# EAGLE design clock (EAGLE 9.0.0)
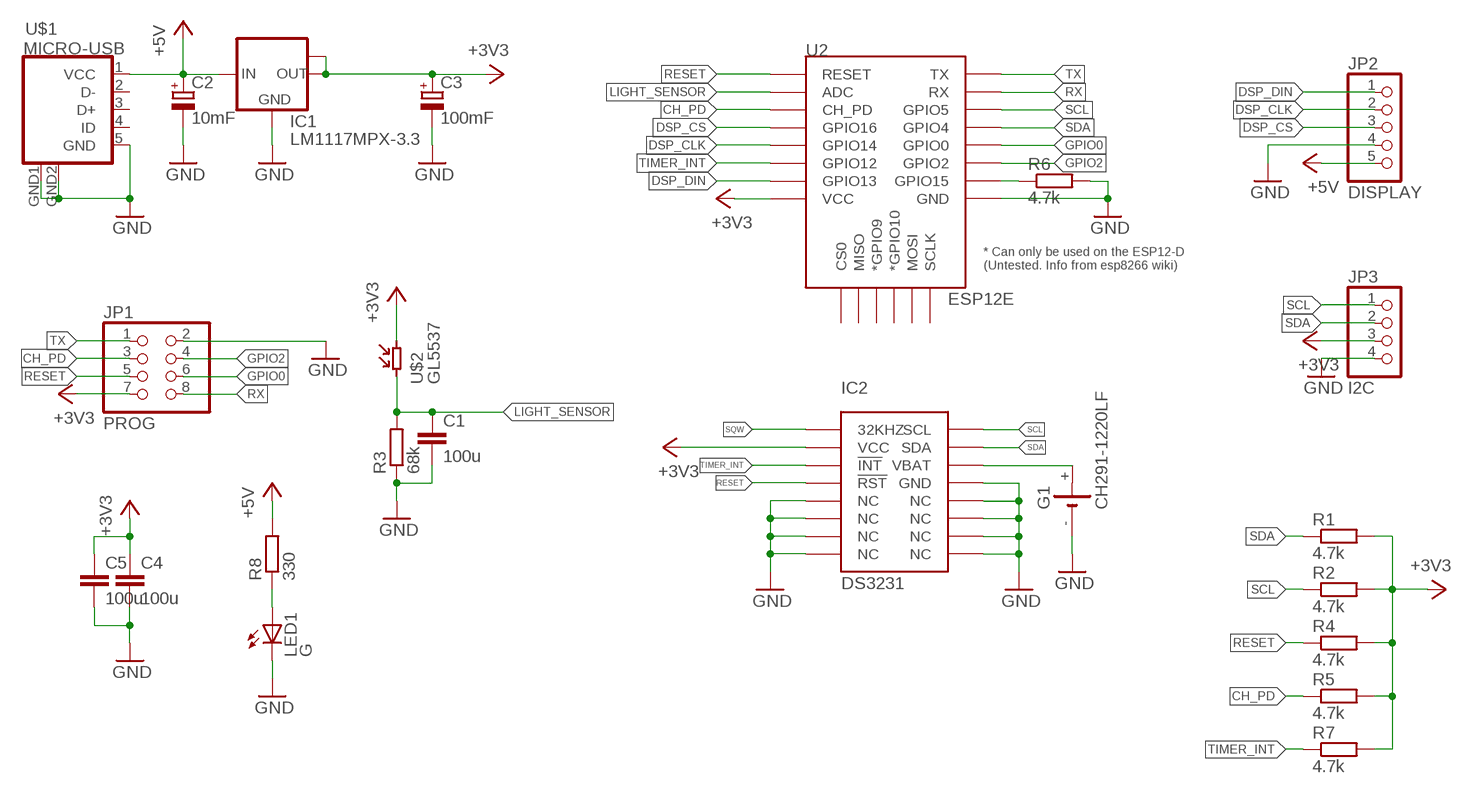
[diagram p0: schematic, sheet 1]

## Parts
C1  100u  C-EUC0805  [C0805]
C2  10mF  CPOL-EUA/3216-18W  [A/3216-18W]
C3  100mF  CPOL-EUA/3216-18W  [A/3216-18W]
C4  100u  C-EUC0805  [C0805]
C5  100u  C-EUC0805  [C0805]
G1  CH291-1220LF  [CH291-1220LF]
IC1  LM1117MPX-3.3  [SOT223]
IC2  DS3231  DS3231SOIC-16W  [SOIC-16W]
JP1  PROG  PINHD-2X4  [2X04]
JP2  DISPLAY  PINHD-1X5  [1X05]
JP3  I2C  PINHD-1X4  [1X04]
LED1  G  LEDCHIPLED_0805  [CHIPLED_0805]
R1  4.7k  R-EU_M0805  [M0805]
R2  4.7k  R-EU_M0805  [M0805]
R3  68k  R-EU_M0805  [M0805]
R4  4.7k  R-EU_M0805  [M0805]
R5  4.7k  R-EU_M0805  [M0805]
R6  4.7k  R-EU_M0805  [M0805]
R7  4.7k  R-EU_M0805  [M0805]
R8  330  R-EU_M0805  [M0805]
U2  ESP12E  ESP12ESMD  [ESP12E-SMD]
U$1  MICRO-USB  [MICRO-USB]
U$2  GL5537  [GL55]

## Nets
+3V3 [power]: C3.+ C4.1 C5.1 IC1.2(OUT) IC1.TAB(OUT1) IC2.2(VCC) JP1.7 JP3.3 R1.2 R2.2 R4.2 R5.2 R7.2 U2.VCC U$2.P$2
+5V [power]: C2.+ IC1.3(IN) JP2.5 R8.2 U$1.1(VCC)
CH_PD: JP1.3 R5.1 U2.CH_PD
DSP_CLK: JP2.2 U2.GPIO14
DSP_CS: JP2.3 U2.GPIO16
DSP_DIN: JP2.1 U2.GPIO13
GND [gnd]: C1.2 C2.- C3.- C4.2 C5.2 G1.- IC1.1(GND) IC2.5(NC) IC2.6(NC) IC2.7(NC) IC2.8(NC) IC2.9(NC) IC2.10(NC) IC2.11(NC) IC2.12(NC) IC2.13(GND) JP1.2 JP2.4 JP3.4 LED1.C R3.1 R6.2 U2.GND U$1.5(GND) U$1.GND1(GND) U$1.GND2(GND)
GPIO0: JP1.6 U2.GPIO0
GPIO2: JP1.4 U2.GPIO2
GPIO15: R6.1 U2.GPIO15
LIGHT_SENSOR: C1.1 R3.2 U2.ADC U$2.P$1
N$3: LED1.A R8.1
N$4: G1.+ IC2.14(VBAT)
RESET: IC2.4(!RST) JP1.5 R4.1 U2.RESET
RX: JP1.8 U2.RXD0(RX)
SCL: IC2.16(SCL) JP3.1 R2.1 U2.GPIO5
SDA: IC2.15(SDA) JP3.2 R1.1 U2.GPIO4
SQW: IC2.1(32KHZ)
TIMER_INT: IC2.3(!INT) R7.1 U2.GPIO12
TX: JP1.1 U2.TXD0(TX)
Unconnected: U2.CS0 U2.GPIO9(*GPIO9) U2.GPIO10(*GPIO10) U2.MISO U2.MOSI U2.SCLK U$1.2(D-) U$1.3(D+) U$1.4(ID)

## Library data of the parts
C1 C4 C5 = rcl:C-EU: CAPACITOR, European symbol; SPICEPREFIX: C
C2 C3 = rcl:CPOL-EU: POLARIZED CAPACITOR, European symbol; SPICEPREFIX: C
G1 = battery:CH291-1220LF: Battery Holder, SMT, 12mm multicomp PART NO. CH291-1220LF Source: Data sheet <http://www.farnell.com/datasheets/1505860.pdf>
IC1 = lm1117:LM1117MPX-*
IC2 = DS3231_industrialberry:DS3231
JP1 = pinhead:PINHD-2X4: PIN HEADER
JP2 = pinhead:PINHD-1X5: PIN HEADER
JP3 = pinhead:PINHD-1X4: PIN HEADER
LED1 = led:LED: LED OSRAM: - CHIPLED LG R971, LG N971, LY N971, LG Q971, LY Q971, LO R971, LY R971 LH N974, LH R974 LS Q976, LO Q976, LY Q976 LO Q996 - Hyper CHIPLED LW Q18S LB Q993, LB Q99A, LB R99A - SideLED LS A670, LO A670, LY A670, LG A670, LP A670 LB A673, LV A673, LT A673, LW A673 LH A674 LY A675 LS A676, LA A676, LO A676, LY A676, LW A676 LS A679, LY A679, LG A679 - Hyper Micro SIDELED® LS Y876, LA Y876, LO Y876, LY Y876 LT Y87S - SmartLED LW L88C, LW L88S LB L89C, LB L89S, LG L890 LS L89K, LO L89K, LY L89K LS L896, LA L896, LO L896, LY L896 - TOPLED LS T670, LO T670, LY T670, LG T670, LP T670 LSG T670, LSP T670, LSY T670, LOP T670, LYG T670 LG T671, LOG T671, LSG T671 LB T673, LV T673, LT T673, LW T673 LH T674 LS T676, LA T676, LO T676, LY T676, LB T676, LH T676, LSB T676, LW T676 LB T67C, LV T67C, LT T67C, LS T67K, LO T67K, LY T67K, LW E67C LS E67B, LA E67B, LO E67B, LY E67B, LB E67C, LV E67C, LT E67C LW T67C LS T679, LY T679, LG T679 LS T770, LO T770, LY T770, LG T770, LP T770 LB T773, LV T773, LT T773, LW T773 LH T774 LS E675, LA E675, LY E675, LS T675 LS T776, LA T776, LO T776, LY T776, LB T776 LHGB T686 LT T68C, LB T68C - Hyper Mini TOPLED® LB M676 - Mini TOPLED Santana® LG M470 LS M47K, LO M47K, LY M47K Source: http://www.osram.convergy.de LUXEON: - LUMILED® LXK2-PW12-R00, LXK2-PW12-S00, LXK2-PW14-U00, LXK2-PW14-V00 LXK2-PM12-R00, LXK2-PM12-S00, LXK2-PM14-U00 LXK2-PE12-Q00, LXK2-PE12-R00, LXK2-PE12-S00, LXK2-PE14-T00, LXK2-PE14-U00 LXK2-PB12-K00, LXK2-PB12-L00, LXK2-PB12-M00, LXK2-PB14-N00, LXK2-PB14-P00, LXK2-PB14-Q00 LXK2-PR12-L00, LXK2-PR12-M00, LXK2-PR14-Q00, LXK2-PR14-R00 LXK2-PD12-Q00, LXK2-PD12-R00, LXK2-PD12-S00 LXK2-PH12-R00, LXK2-PH12-S00 LXK2-PL12-P00, LXK2-PL12-Q00, LXK2-PL12-R00 Source: www.luxeon.com KINGBRIGHT: KA-3528ASYC Source: www.kingbright.com
R1-R8 = rcl:R-EU_: RESISTOR, European symbol; SPICEPREFIX: R
U2 = esp8266modules:ESP12E: ESP12E Module
U$1 = microusb:MICRO-USB: Micro USB B connector
U$2 = misc:GL5537: GL5537 Photoresistor

## Net classes
0 default: width 0.3 mm
1 power: width 0.5 mm
2 gnd: width 0.5 mm

## Board
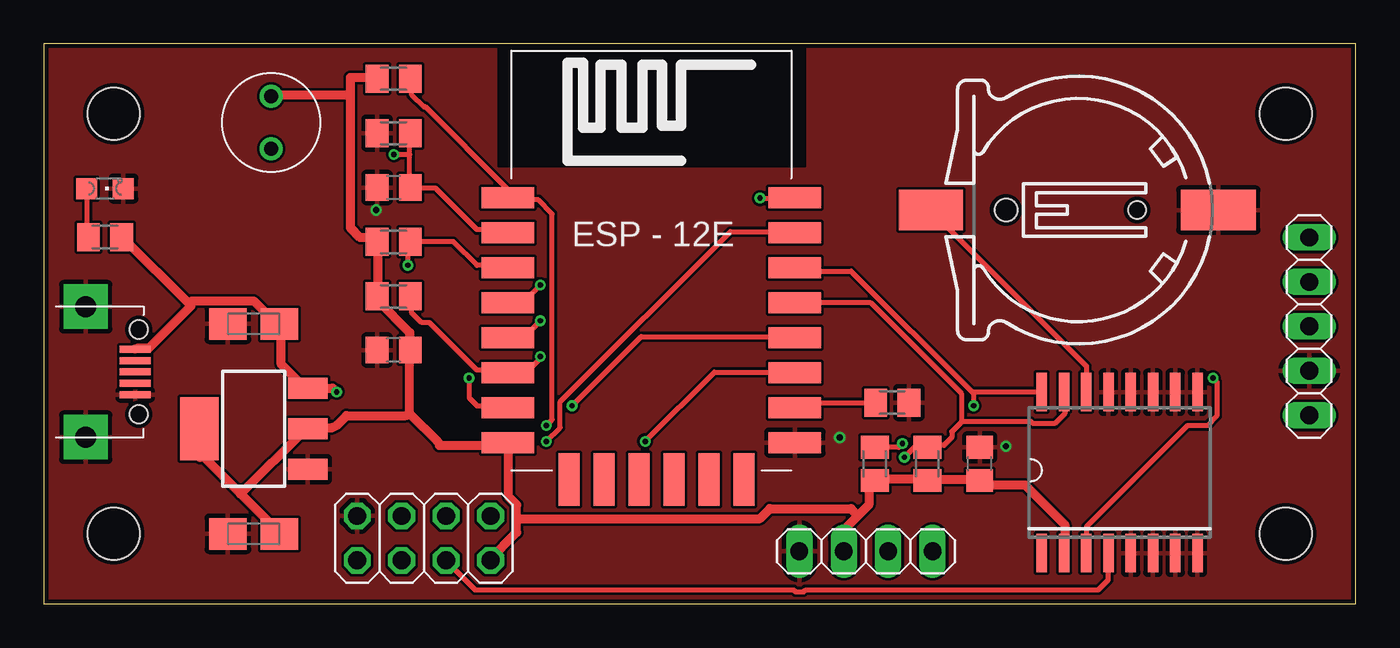
[diagram p1: board, top side]
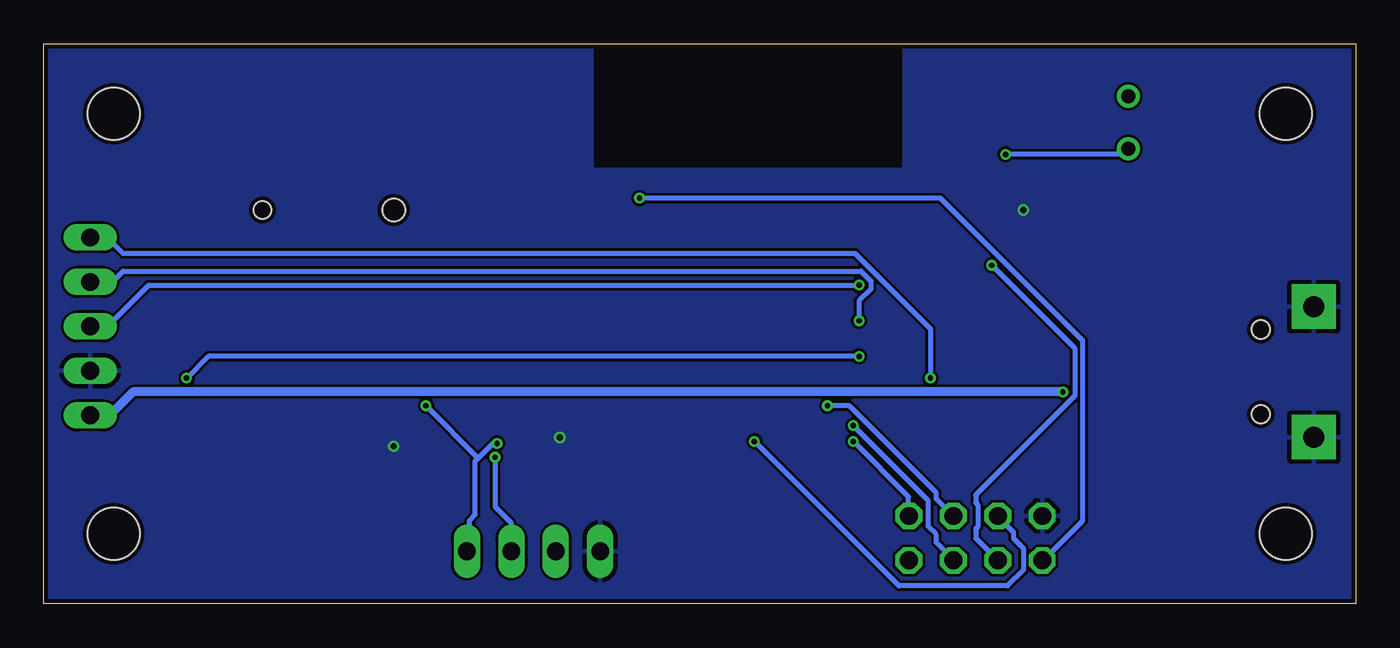
[diagram p2: board, bottom side, seen from below]

Size 75 x 32 mm. Coordinates in mm from the lower left corner, seen from the top.
Outline: 0,0 75,0 75,32 0,32 0,0
Copper layers (1*16): Top 0.035mm / dielectric 1.5mm / Bottom 0.035mm
Design rules "SeeedStudio_2layer_DRU_no_angle_20140221": minimum track width 6mil, minimum drill 12mil, track to track 6mil, track to pad 6mil, pad to pad 6mil, via to via 6mil, smd to smd 0mil, copper to edge 10mil, drill to drill 10mil, minimum pad ring 10mil, minimum via ring 6mil, stop-mask expansion 2mil, vias tented up to drill 100mil, thermal gap 10mil
Holes 3 mm at 4,4 4,28 71,4 71,28
tRestrict: area 26,25 to 43.5,32
bRestrict: area 26,25 to 43.5,32

### Footprints (pad centres in the part's own frame; a part is rotated, then mirrored left to right if it is on the bottom)
C0805 = smd 1.3 x 1.5: 1 -0.95,0; 2 0.95,0
A/3216-18W = smd 2.15 x 1.8: + 1.475,0; - -1.475,0
CH291-1220LF = smd 2.3 x 3.66: + 0,-2.296 | smd 2.3 x 4.3: - 0,14.146 | hole 1.3: 0,2 | hole 1: 0,9.5
SOT223 = smd 1.219 x 2.235: 1 -2.311,-3.099; 2 0,-3.099; 3 2.311,-3.099 | smd 3.6 x 2.2: TAB 0,3.099
SOIC-16W = smd 0.6 x 2.2: 1 -4.445,-4.6; 2 -3.175,-4.6; 3 -1.905,-4.6; 4 -0.635,-4.6; 5 0.635,-4.6; 6 1.905,-4.6; 7 3.175,-4.6; 8 4.445,-4.6; 9 4.445,4.6; 10 3.175,4.6; 11 1.905,4.6; 12 0.635,4.6; 13 -0.635,4.6; 14 -1.905,4.6; 15 -3.175,4.6; 16 -4.445,4.6
2X04 = drill 1.016 octagon: 1 -3.81,-1.27; 2 -3.81,1.27; 3 -1.27,-1.27; 4 -1.27,1.27; 5 1.27,-1.27; 6 1.27,1.27; 7 3.81,-1.27; 8 3.81,1.27
1X05 = drill 1.016 long: 1 -5.08,0; 2 -2.54,0; 3 0,0; 4 2.54,0; 5 5.08,0
1X04 = drill 1.016 long: 1 -3.81,0; 2 -1.27,0; 3 1.27,0; 4 3.81,0
CHIPLED_0805 = smd 1.2 x 1.2: A 0,-1.05; C 0,1.05
M0805 = smd 1.3 x 1.6: 1 -0.95,0; 2 0.95,0
ESP12E-SMD = smd 3 x 1.2: ADC -8.3,3.8; CH_PD -8.3,1.8; GND 8.1,-8.2; GPIO0 8.1,-2.2; GPIO2 8.1,-4.2; GPIO4 8.1,-0.2; GPIO5 8.1,1.8; GPIO12 -8.3,-4.2; GPIO13 -8.3,-6.2; GPIO14 -8.3,-2.2; GPIO15 8.1,-6.2; GPIO16 -8.3,-0.2; RESET -8.3,5.8; RXD0 8.1,3.8; TXD0 8.1,5.8; VCC -8.3,-8.2 | smd 1.2 x 3: CS0 -4.8,-10.3; GPIO9 -0.8,-10.3; GPIO10 1.2,-10.3; MISO -2.8,-10.3; MOSI 3.2,-10.3; SCLK 5.2,-10.3
MICRO-USB = smd 0.4 x 1.75: 1 -1.3,4.525; 2 -0.65,4.525; 3 0,4.525; 4 0.65,4.525; 5 1.3,4.525 | drill 1.2 pad 2.54 square: GND1 -3.725,1.7; GND2 3.725,1.7 | hole 1.05: -2.425,4.73; 2.425,4.73
GL55 = drill 0.8: P$1 -1.5,0; P$2 1.5,0

### Placement (x,y rotation side)
C1  20,23.78 180 top
C2  12,16 0 top
C3  12,4 0 top
C4  53.5,8 90 top
C5  20,14.5 180 top
G1  53,22.5 270 top
IC1  12,10 90 top
IC2  61.5,7.5 0 top
JP1  21.73,3.75 0 top
JP2  72.34,15.85 270 top
JP3  47,3 180 top
LED1  3.5,23.73 270 top
R1  50.5,8 270 top
R2  47.5,8 270 top
R3  20,26.89 0 top
R4  20,30 180 top
R5  20,20.67 180 top
R6  48.5,11.5 0 top
R7  20,17.56 180 top
R8  3.5,20.95 0 top
U2  34.83,17.41 0 top
U$1  0.7,13.25 270 top
U$2  13,27.5 90 top

### Tracks (layer width: path | path; a pad name or v marks a point on that pad's centre or on a via)
+3V3
  Top 0.5: IC2.2 58.36,2.94 58.36,4.52 56.1,6.79 53.95,6.79 53.72,7.01 C4.1 53.5,7.12 50.56,7.12 R1.2 50.33,7.12 47.5,7.12 R2.2 47.39,6.9 47.16,6.67 47.16,5.66 46.54,5.03 | 46.54,5.03 45.81,4.3 45.81,3.05 JP3.3 | 27.03,4.86 27.03,4.07 25.45,2.49 JP1.7 | 27.03,4.86 27.03,5.66 26.58,6.11 26.58,9.16 U2.VCC 26.35,9.05 22.62,9.05 22.51,9.27 20.92,10.86 | R4.2 19,30.09 17.53,30.09 17.53,29.07 | 19.11,17.53 R7.2 | R7.2 19.11,17.76 19.11,20.58 R5.2 19,20.92 18.1,20.92 17.53,21.49 17.53,29.07 | 8.94,8.37 8.94,9.84 IC1.TAB | 15.27,10.07 15.38,10.07 | 15.38,10.07 16.51,10.07 16.74,10.18 17.3,10.74 20.7,10.74 20.92,10.86 | 46.54,5.03 46.15,5.43 41.51,5.43 40.94,4.86 27.03,4.86 | 8.26,10.63 8.82,10.07 IC1.TAB | 17.53,29.07 13.01,29.07 U$2.P$2 | 15.15,9.95 IC1.2 | 15.38,10.07 IC1.2 | 11.25,6.28 9.16,8.37 IC1.TAB | 11.25,6.28 13.46,4.07 C3.+ | 11.25,6.28 14.93,9.95 IC1.2 | R7.2 19.11,17.3 20.92,15.49 20.92,14.59 C5.1 20.92,14.25 20.92,10.86
+5V  (via drill 0.3)
  Top 0.5: 15.04,12.33 IC1.3 | v16.74,12.1 16.51,12.33 15.27,12.33 IC1.3 | 8.31,17.14 8.43,17.02 5.99,14.59 5.32,14.59 U$1.1 | 8.31,17.14 4.52,20.92 R8.2 | IC1.3 14.82,12.44 13.57,13.69 13.57,15.95 C2.+ 13.23,16.06 11.99,17.3 8.48,17.3 8.31,17.14
  Bottom 0.5: v16.74,12.1 69.9,12.1 71.14,10.86 72.27,10.86 JP2.5
CH_PD  (via drill 0.3)
  Top 0.3: U2.CH_PD 26.46,19.23 26.35,19.34 24.77,19.34 23.41,20.7 21.04,20.7 R5.1 20.81,20.7 v20.81,19.34
  Bottom 0.3: v20.81,19.34 16.06,14.59 16.06,11.88 21.71,6.22 21.71,5.77 21.6,5.66 21.6,4.41 21.71,4.3 21.71,3.73 JP1.3
DSP_CLK  (via drill 0.3)
  Top 0.3: v28.39,16.17 27.48,15.27 26.58,15.27 U2.GPIO14
  Bottom 0.3: v28.39,16.17 28.39,17.3 27.71,17.98 27.71,18.43 28.27,19 70.46,19 71.03,18.43 72.27,18.43 JP2.2
DSP_CS  (via drill 0.3)
  Top 0.3: v28.39,18.21 27.48,17.3 26.58,17.3 U2.GPIO16
  Bottom 0.3: v28.39,18.21 68.99,18.21 71.25,15.95 72.27,15.95 JP2.3
DSP_DIN  (via drill 0.3)
  Top 0.3: v24.32,12.89 24.32,11.76 24.77,11.31 26.46,11.31 U2.GPIO13
  Bottom 0.3: v24.32,12.89 24.32,15.72 28.61,20.02 70.46,20.02 71.37,20.92 72.27,20.92 JP2.1
GND  (via drill 0.35)
  other vias: 19,22.5 45.5,9.5 55,9
  pour Bottom: 0,0 75,0 75,32 0,32
  pour Top: 0,0 75,0 75,32 0,32
GPIO0  (via drill 0.3)
  Top 0.3: v30.2,11.31 34.16,15.27 42.87,15.27 U2.GPIO0
  Bottom 0.3: v30.2,11.31 28.95,11.31 23.98,6.33 23.98,5.99 23.07,5.09 JP1.6
GPIO2  (via drill 0.3)
  Top 0.3: v34.38,9.27 38.34,13.23 42.87,13.23 U2.GPIO2
  Bottom 0.3: v34.38,9.27 26.13,1.02 19.91,1.02 19,1.92 19,3.17 19.57,3.73 19.57,4.07 20.47,4.98 JP1.4
GPIO15
  Top 0.3: 42.98,11.31 U2.GPIO15 43,11.38 43.12,11.5 R6.1
LIGHT_SENSOR  (via drill 0.3)
  Top 0.3: 20.92,23.86 C1.1 | 20.92,26.8 R3.2 20.92,26.69 20.92,25.67 | C1.1 21.04,23.75 22.39,23.75 24.77,21.38 26.35,21.38 26.46,21.26 U2.ADC | 20.92,25.67 20.92,23.98 C1.1 | v20.02,25.67 20.92,25.67
  Bottom 0.3: v20.02,25.67 13.23,25.67 13.01,25.9 U$2.P$1
N$3
  Top 0.3: LED1.A 2.49,23.64 2.49,21.04 R8.1
N$4
  Top 0.3: IC2.14 59.6,12.1 59.6,13.57 50.78,22.39 G1.+
RESET  (via drill 0.3)
  Top 0.3: R4.1 21.04,29.97 21.04,29.07 21.71,28.39 21.83,28.39 26.46,23.75 26.46,23.3 U2.RESET 26.58,23.07 28.27,23.07 29.07,22.28 29.07,10.52 v28.73,10.18 | IC2.4 60.85,2.83 60.85,1.36 60.28,0.79 43.54,0.79 43.43,0.68 42.98,0.68 42.87,0.79 24.66,0.79 23.07,2.38 JP1.5
  Bottom 0.3: v28.73,10.18 24.43,5.88 24.43,4.41 23.98,3.96 23.98,3.51 22.96,2.49 JP1.5
RX  (via drill 0.3)
  Top 0.3: v28.73,9.27 29.52,10.07 29.52,11.54 39.25,21.26 42.87,21.26 U2.RXD0
  Bottom 0.3: v28.73,9.27 25.56,6.11 25.56,5.09 JP1.8
SCL  (via drill 0.3)
  Top 0.3: v49.09,9.16 48.86,8.94 47.5,8.94 R2.1 | 53.16,12.1 53.04,12.1 46.15,19 43.09,19 42.98,19.11 U2.GPIO5 | 53.16,12.1 57,12.1 IC2.16 | 53.16,12.1 v53.16,11.31
  Bottom 0.3: v49.09,9.16 49.31,9.16 50.16,8.31 | 50.16,8.31 50.33,8.14 50.33,5.09 50.67,4.75 50.67,4.52 50.78,4.41 50.78,3.05 JP3.1 | v53.16,11.31 50.16,8.31
SDA  (via drill 0.3)
  Top 0.3: 52.48,10.4 51.91,9.84 51.91,9.5 51.46,9.05 50.56,9.05 R1.1 50.44,8.94 49.76,8.94 v49.2,8.37 | 52.48,10.4 56.44,10.4 56.55,10.29 57.79,10.29 58.36,10.86 58.36,11.99 IC2.15 | 52.48,10.4 52.48,11.99 47.28,17.19 42.98,17.19 U2.GPIO4
  Bottom 0.3: v49.2,8.37 49.2,5.54 48.29,4.64 48.29,3.05 JP3.2
TIMER_INT  (via drill 0.3)
  Top 0.3: R7.1 21.04,17.53 21.04,16.63 21.6,16.06 22.05,16.06 24.77,13.35 26.35,13.35 26.46,13.23 U2.GPIO12 26.58,13.35 27.71,13.35 28.39,14.02 v28.39,14.14 | v66.84,12.89 67.07,12.67 67.07,10.74 66.5,10.18 65.37,10.18 59.6,4.41 59.6,2.94 IC2.3
  Bottom 0.3: v66.84,12.89 65.6,14.14 v28.39,14.14
TX  (via drill 0.3)
  Top 0.3: v40.94,23.19 42.87,23.19 U2.TXD0
  Bottom 0.3: v40.94,23.19 23.75,23.19 15.61,15.04 15.61,4.75 17.87,2.49 JP1.1